# EAGLE design PowerSupply (EAGLE 9.2.2)
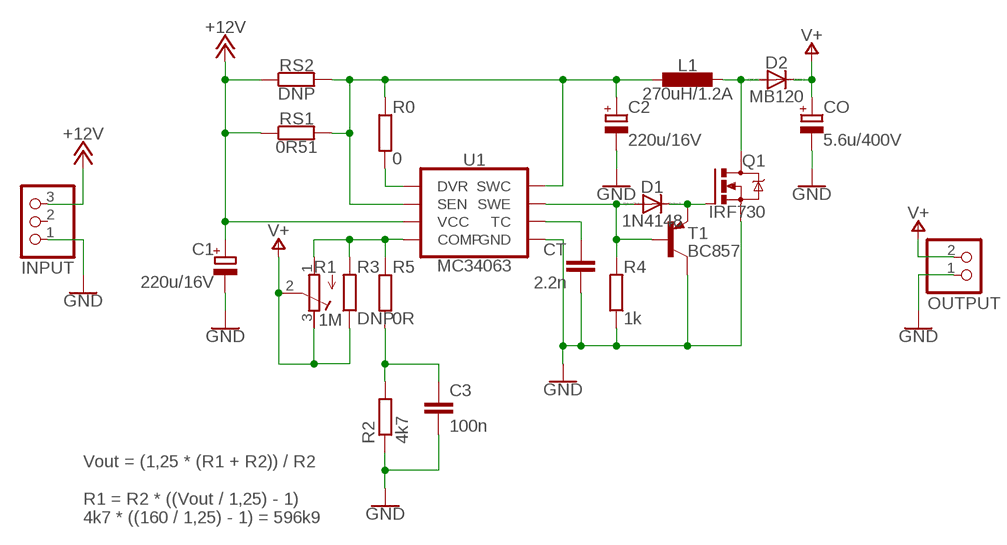
[diagram p0: schematic, sheet 1]

## Parts
C1  220u/16V  CPOL-EU140CLH-0810  [140CLH-0810]
C2  220u/16V  CPOL-EU140CLH-0810  [140CLH-0810]
C3  100n  C-EUC0603K  [C0603K]
CO  5.6u/400V  CPOL-EU153CLV-1010  [153CLV-1010]
CT  2.2n  C-EUC0603K  [C0603K]
D1  1N4148  DIODE-SOD323-W  [SOD323-W]
D2  MB120  DIODE-DO214AA  [DO214AA]
INPUT  PINHD-1X3  [1X03]
L1  270uH/1.2A  TC-PIS4728  [TC-PIS4728]
OUTPUT  PINHD-1X2  [1X02]
Q1  IRF730  IRF740  [TO220BV]
R0  0  R-EU_R0603  [R0603]
R1  1M  R-TRIMM64W  [RTRIM64W]
R2  4k7  R-EU_R0603  [R0603]
R3  DNP  R-EU_R0603  [R0603]
R4  1k  R-EU_R0603  [R0603]
R5  0R  R-EU_R0603  [R0603]
RS1  0R51  R-EU_R2512  [R2512]
RS2  DNP  R-EU_R2512  [R2512]
T1  BC857  BC857A-PNP-SOT23-BEC  [SOT23-BEC]
U1  MC34063  [SOIC127P600X175-8]

## Nets
+12V: C1.+ INPUT.3 RS1.1 RS2.1 U1.6(VCC)
GND: C1.- C2.- C3.2 CO.- CT.1 INPUT.1 OUTPUT.1 Q1.S R2.1 R4.1 T1.C U1.4(GND)
N$1: D1.A R4.2 T1.B U1.2(SWE)
N$2: D1.C Q1.G T1.E
N$3: R0.2 U1.8(DVR)
N$4: D2.A L1.P$1 Q1.D
N$5: CT.2 U1.3(TC)
N$6: R1.1(A) R3.2 R5.1 U1.5(COMP)
N$7: C3.1 R2.2 R5.2
N$8: C2.+ L1.P$2 R0.1 RS1.2 RS2.2 U1.1(SWC) U1.7(SEN)
V+: CO.+ D2.C OUTPUT.2 R1.2(S) R1.3(E) R3.1
Unconnected: INPUT.2

## Notes on the sheet
- Vout = (1,25 * (R1 + R2)) / R2
  
  R1 = R2 * ((Vout / 1,25) - 1)
  4k7 * ((160 / 1,25) - 1) = 596k9

## Library data of the parts
C1 C2 CO = rcl:CPOL-EU: POLARIZED CAPACITOR, European symbol; SPICEPREFIX: C
C3 CT = rcl:C-EU: CAPACITOR, European symbol; SPICEPREFIX: C
D1 D2 = diode:DIODE-: DIODE
INPUT = pinhead:PINHD-1X3: PIN HEADER
L1 = NixieClock:TC-PIS4728
OUTPUT = pinhead:PINHD-1X2: PIN HEADER
Q1 = transistor-power:IRF740: N-CHANNEL MOS FET; SPICEPREFIX: Q
R0 R2-R5 RS1 RS2 = rcl:R-EU_: RESISTOR, European symbol; SPICEPREFIX: R
R1 = rcl:R-TRIMM: Trimm resistor; SPICEMODEL: X; SPICEPREFIXL: POT
T1 = DC_LOAD_AU:*-PNP-: PNP Transistror
U1 = NixieClock:MC34063; SPICEPREFIX: X

## Board
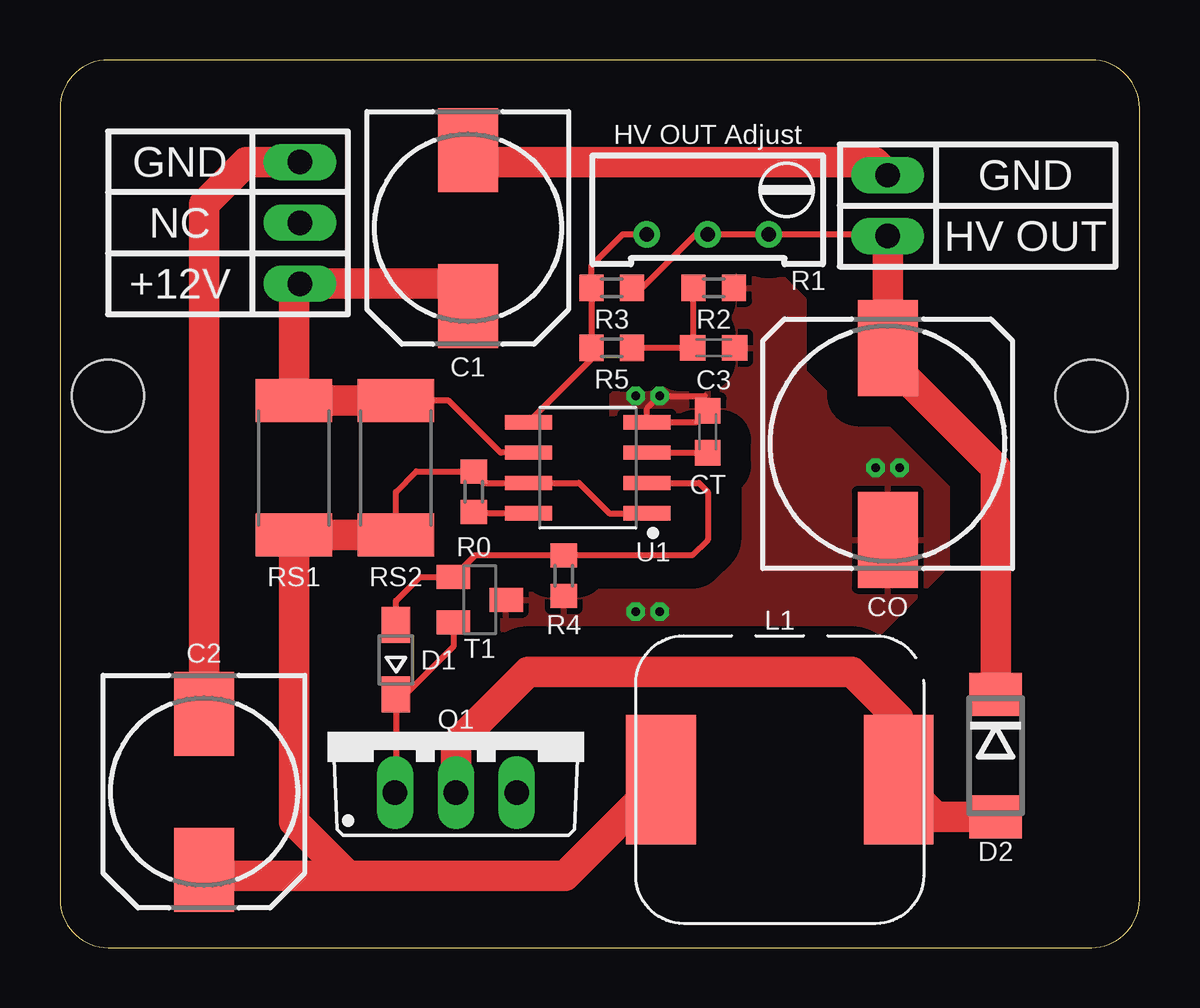
[diagram p1: board, top side]
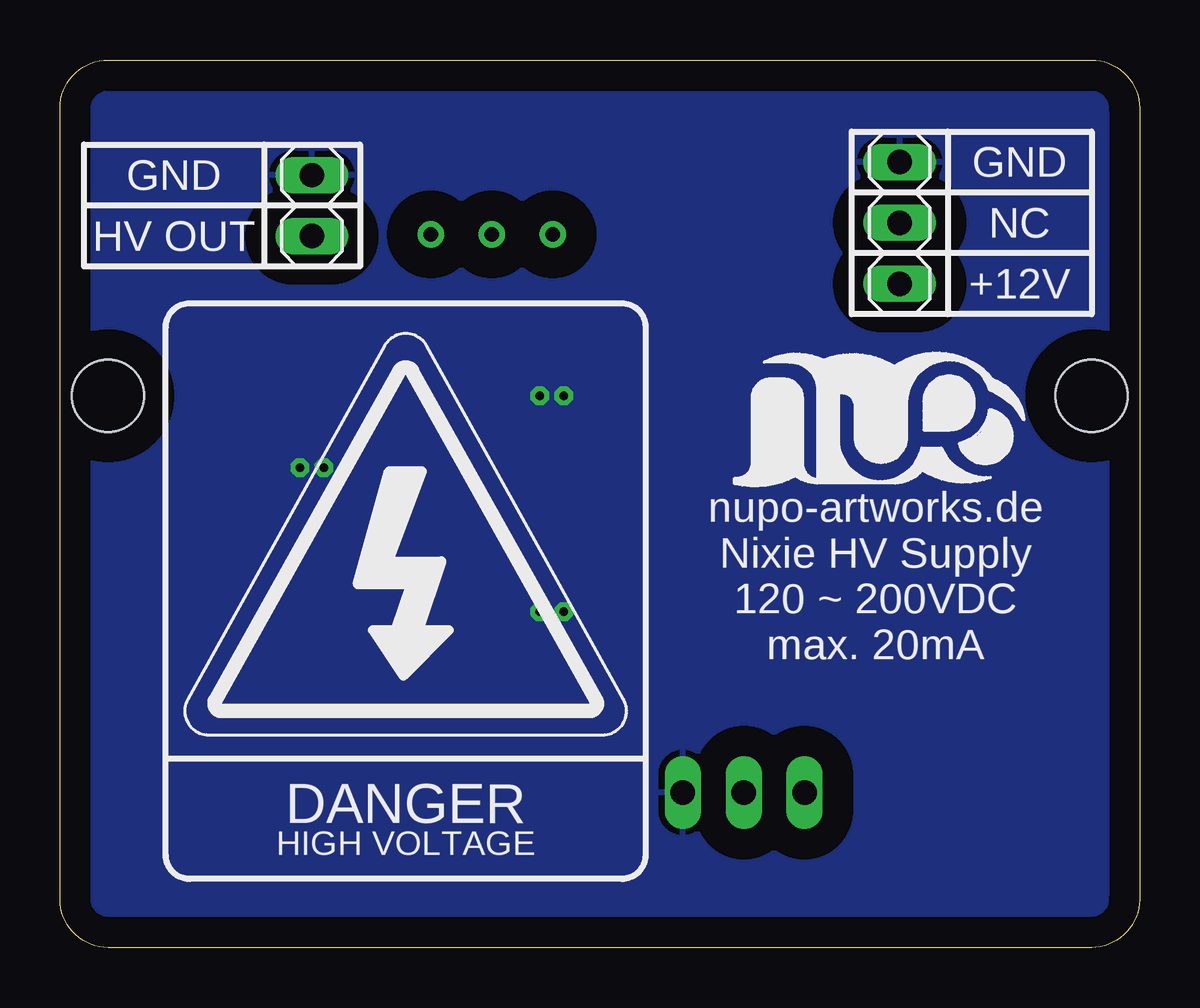
[diagram p2: board, bottom side, seen from below]

Size 45 x 37 mm. Coordinates in mm from the lower left corner, seen from the top.
Outline: 0,35 0,2 arc90 2,0 43,0 arc90 45,2 45,35 arc90 43,37 2,37 arc90 0,35
Copper layers (1*16): Top 0.035mm / dielectric 1.5mm / Bottom 0.035mm
Design rules "default *": minimum track width 6mil, minimum drill 0.35mm, track to track 6mil, track to pad 6mil, pad to pad 6mil, via to via 6mil, smd to smd 6mil, copper to edge 40mil, drill to drill 6mil, minimum pad ring 10mil, minimum via ring 8mil, stop-mask expansion 4mil, vias tented up to drill 40mil, thermal gap 10mil
Holes 3 mm at 2,23 43,23

### Footprints (pad centres in the part's own frame; a part is rotated, then mirrored left to right if it is on the bottom)
140CLH-0810 = smd 3.5 x 2.5: + 3.25,0; - -3.25,0
C0603K = smd 1.05 x 1.08: 1 -0.875,0; 2 0.875,0
153CLV-1010 = smd 4 x 2.5: + 4,0; - -4,0
SOD323-W = smd 1.5 x 1.2: A 1.45,0; C -1.45,0
DO214AA = smd 1.8 x 2.2: A 2.55,0; C -2.55,0
1X03 = drill 1.016 long: 1 -2.54,0; 2 0,0; 3 2.54,0
TC-PIS4728 = smd 5.4 x 2.9: P$1 0,4.95; P$2 0,-4.95
1X02 = drill 1.016 long: 1 -1.27,0; 2 1.27,0
TO220BV = drill 1.016 long: D 0,-2.54; G -2.54,-2.54; S 2.54,-2.54
R0603 = smd 1 x 1.1: 1 -0.85,0; 2 0.85,0
RTRIM64W = drill 0.61: 1 1.27,-2.54; 2 1.27,0; 3 1.27,2.54
R2512 = smd 1.8 x 3.2: 1 -2.8,0; 2 2.8,0
SOT23-BEC = smd 1 x 1.4: B -0.95,-1.1; C 0,1.1; E 0.95,-1.1
SOIC127P600X175-8 = smd 1.968 x 0.602: 1 -2.473,1.905; 2 -2.473,0.635; 3 -2.473,-0.635; 4 -2.473,-1.905; 5 2.473,-1.905; 6 2.473,-0.635; 7 2.473,0.635; 8 2.473,1.905

### Placement (x,y rotation side)
C1  17,30 270 top
C2  6,6.5 270 top
C3  27.25,25 0 top
CO  34.5,21 90 top
CT  27,21.5 270 top
D1  14,12 90 top
D2  39,8 270 top
INPUT  10,30.21 270 bottom
L1  30,7 270 top
OUTPUT  34.5,30.93 270 bottom
Q1  16.5,9 0 top
R0  17.25,19 270 top
R1  27,31 270 top
R2  27.25,27.5 180 top
R3  23,27.5 180 top
R4  21,15.5 90 top
R5  23,25 0 top
RS1  9.75,20 270 top
RS2  14,20 270 top
T1  17.5,14.5 270 top
U1  22,20 180 top
U$1  [SIGN-HV]  31,15 0 bottom
U$2  [LOGO-SILKSCREEN]  11,21 0 bottom

### Tracks (layer width: path | path; a pad name or v marks a point on that pad's centre or on a via)
+12V
  Top 0.254: U1.6 18.36,20.64 16.2,22.8 RS2.1
  Top 1.27: RS2.1 RS1.1 9.75,27.42 INPUT.3 16.08,27.67 C1.+
GND  (via drill 0.35)
  Top 0.254: C1.- 17.5,32.75 24,32.75 | 26.88,23 v25,23 24.47,22.47 U1.4 26.53,21.91 CT.1
  Top 1.27: C1.- 16.5,32.75 24,32.75 33.95,32.75 OUTPUT.1 | C2.- 6,31 7.75,32.75 INPUT.1
  other vias: 24,23 24,14 25,14 35,20 34,20
  pour Top (isolate 1.27): 11,15.5 11,12 18,12 19,13 34,13 37,16 37,20 34,23 32,23 31,24 31,27 30,28 24,28 24,24 23,23 23,16.5 22,15.5
  pour Bottom (isolate 1.27): 0,0 0,37 45,37 45,0
N$1
  Top 0.254: U1.2 26.64,19.36 27,19 27,17 26.35,16.35 R4.2 17.3,16.35 T1.B 15,15.45 14,14.45 D1.A
N$2
  Top 0.254: Q1.G 14,6.5 14,10.15 | 14,10.15 16.4,12.55 T1.E | D1.C 14,10.15
N$3
  Top 0.254: U1.8 17.3,18.09 R0.2
N$4
  Top 1.27: Q1.D 16.5,8.5 19.5,11.5 33,11.5 34.95,9.55 L1.P$1 36.5,5.45 D2.A
N$5
  Top 0.254: U1.3 26.99,20.64 CT.2
N$6
  Top 0.254: R1.1 23.46,29.73 22.15,28.42 R3.2 R5.1 22.15,24.53 U1.5
N$7
  Top 0.254: R5.2 C3.1 26.38,27.48 R2.2
N$8
  Top 0.254: U1.1 22.91,18.09 21.64,19.36 U1.7 17.64,19.36 17.25,19.75 R0.1 14.85,19.85 14,19 RS2.2
  Top 1.27: RS2.2 RS1.2 9.75,5.25 12,3 | 12,3 21.05,3 L1.P$2 | 12,3 6.25,3 C2.+
V+
  Top 0.254: OUTPUT.2 34.43,29.73 R1.3 R1.2 26.5,29.73 24.27,27.5 R3.1
  Top 1.27: CO.+ 35,25.5 | D2.C 39,20 34.5,24.5 CO.+ | CO.+ OUTPUT.2

### Text on the board
tNames: HV OUT Adjust | GND | GND | NC | HV OUT | +12V | L1
bNames: GND | GND | NC | HV OUT | +12V | nupo-artworks.de / Nixie HV Supply / 120 ~ 200VDC / max. 20mA